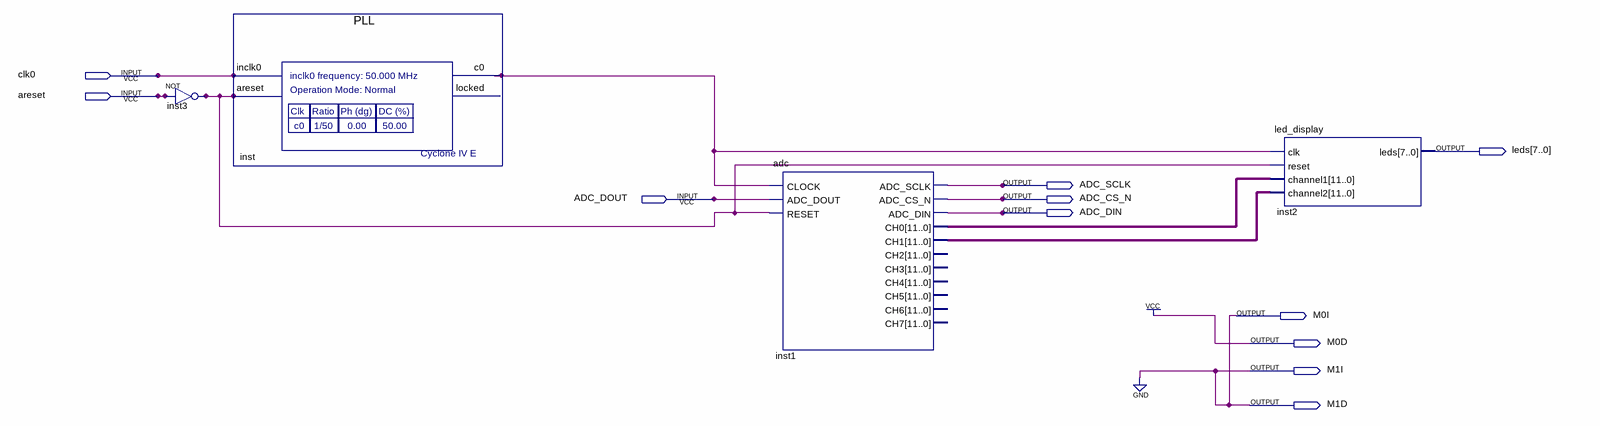
[diagram p0: schematic sheet]
// Quartus schematic ADC_tutorialV3.bdf as structural Verilog: 4 symbols, 11 pins
module ADC_tutorialV3 (
  input  clk0,
  input  areset,
  input  ADC_DOUT,
  output [7:0] leds,
  output ADC_SCLK,
  output ADC_CS_N,
  output ADC_DIN,
  output M0I,
  output M0D,
  output M1I,
  output M1D
);

  wire inst3_out, inst_c0;
  wire [11:0] inst1_ch0, inst1_ch1;

  not inst3 (inst3_out, areset);
  PLL inst (.inclk0(clk0), .areset(inst3_out), .c0(inst_c0));  // open: locked
  adc inst1 (
    .CLOCK(inst_c0), .ADC_DOUT(ADC_DOUT), .RESET(inst3_out), .ADC_SCLK(ADC_SCLK), .ADC_CS_N(ADC_CS_N),
    .ADC_DIN(ADC_DIN), .CH0(inst1_ch0), .CH1(inst1_ch1));  // open: CH2, CH3, CH4, CH5, CH6, CH7
  led_display inst2 (.clk(inst_c0), .reset(inst3_out), .channel1(inst1_ch0), .channel2(inst1_ch1), .leds(leds));

  assign M0D = 1'b1;
  assign M0I = 1'b0;
  assign M1D = 1'b0;
  assign M1I = 1'b0;
endmodule
